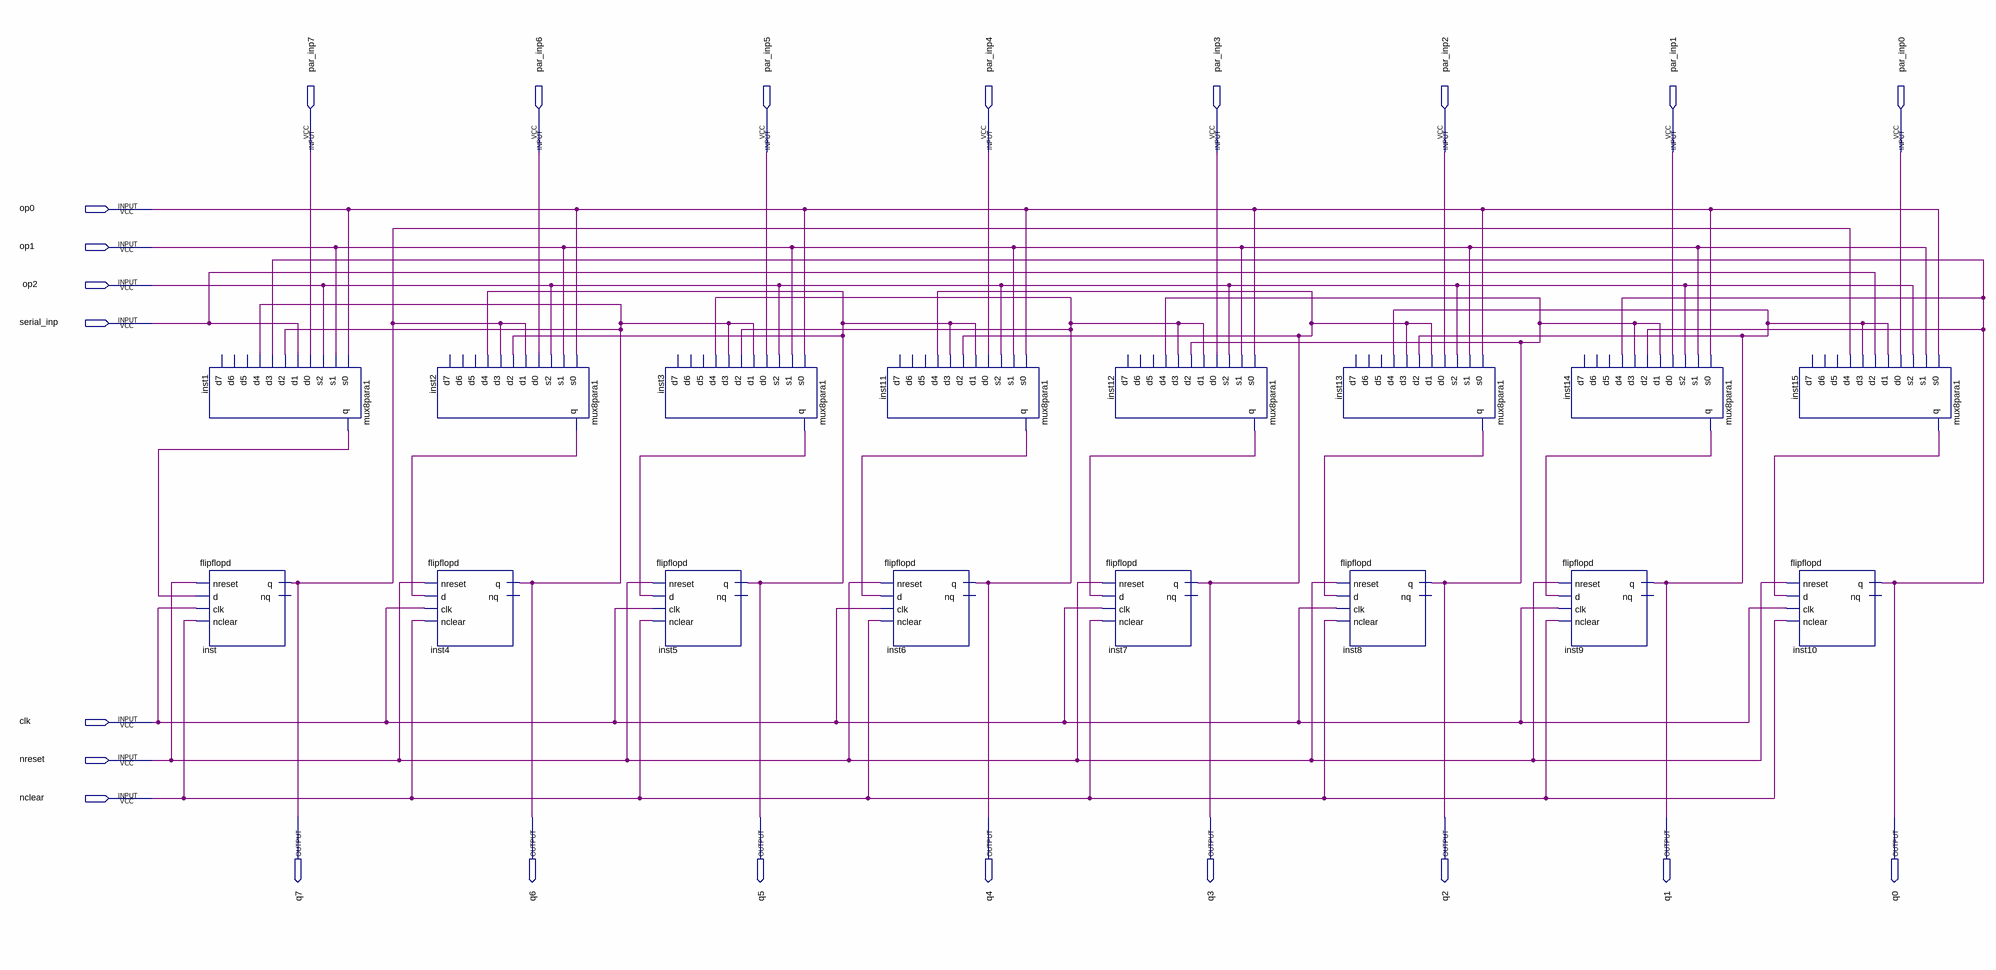
[diagram p0: schematic sheet]
// Quartus schematic registrador_universal.bdf as structural Verilog: 16 symbols, 23 pins
module registrador_universal (
  input  par_inp7,
  input  par_inp6,
  input  par_inp5,
  input  par_inp4,
  input  par_inp3,
  input  par_inp2,
  input  par_inp1,
  input  par_inp0,
  input  op0,
  input  op1,
  input  op2,
  input  serial_inp,
  input  clk,
  input  nreset,
  input  nclear,
  output q7,
  output q6,
  output q5,
  output q4,
  output q3,
  output q2,
  output q1,
  output q0
);

  wire inst1_q, inst2_q, inst3_q, inst11_q, inst12_q, inst13_q, inst14_q, inst15_q;

  mux8para1 inst1 (
    .s0(op0), .s1(op1), .s2(op2), .d0(par_inp7), .d1(serial_inp), .d2(q6), .d3(q0), .d4(q6), .q(inst1_q));  // open: d5, d6, d7
  flipflopd inst (.nreset(nreset), .d(inst1_q), .clk(clk), .nclear(nclear), .q(q7));  // open: nq
  mux8para1 inst2 (
    .s0(op0), .s1(op1), .s2(op2), .d0(par_inp6), .d1(q7), .d2(q5), .d3(q7), .d4(q5), .q(inst2_q));  // open: d5, d6, d7
  flipflopd inst4 (.nreset(nreset), .d(inst2_q), .clk(clk), .nclear(nclear), .q(q6));  // open: nq
  mux8para1 inst3 (
    .s0(op0), .s1(op1), .s2(op2), .d0(par_inp5), .d1(q6), .d2(q4), .d3(q6), .d4(q4), .q(inst3_q));  // open: d5, d6, d7
  flipflopd inst5 (.nreset(nreset), .d(inst3_q), .clk(clk), .nclear(nclear), .q(q5));  // open: nq
  mux8para1 inst11 (
    .s0(op0), .s1(op1), .s2(op2), .d0(par_inp4), .d1(q5), .d2(q3), .d3(q5), .d4(q3), .q(inst11_q));  // open: d5, d6, d7
  flipflopd inst6 (.nreset(nreset), .d(inst11_q), .clk(clk), .nclear(nclear), .q(q4));  // open: nq
  mux8para1 inst12 (
    .s0(op0), .s1(op1), .s2(op2), .d0(par_inp3), .d1(q4), .d2(q2), .d3(q4), .d4(q2), .q(inst12_q));  // open: d5, d6, d7
  flipflopd inst7 (.nreset(nreset), .d(inst12_q), .clk(clk), .nclear(nclear), .q(q3));  // open: nq
  mux8para1 inst13 (
    .s0(op0), .s1(op1), .s2(op2), .d0(par_inp2), .d1(q3), .d2(q1), .d3(q3), .d4(q1), .q(inst13_q));  // open: d5, d6, d7
  flipflopd inst8 (.nreset(nreset), .d(inst13_q), .clk(clk), .nclear(nclear), .q(q2));  // open: nq
  mux8para1 inst14 (
    .s0(op0), .s1(op1), .s2(op2), .d0(par_inp1), .d1(q2), .d2(q0), .d3(q2), .d4(q0), .q(inst14_q));  // open: d5, d6, d7
  flipflopd inst9 (.nreset(nreset), .d(inst14_q), .clk(clk), .nclear(nclear), .q(q1));  // open: nq
  mux8para1 inst15 (
    .s0(op0), .s1(op1), .s2(op2), .d0(par_inp0), .d1(q1), .d2(serial_inp), .d3(q1), .d4(q7), .q(inst15_q));  // open: d5, d6, d7
  flipflopd inst10 (.nreset(nreset), .d(inst15_q), .clk(clk), .nclear(nclear), .q(q0));  // open: nq
endmodule
